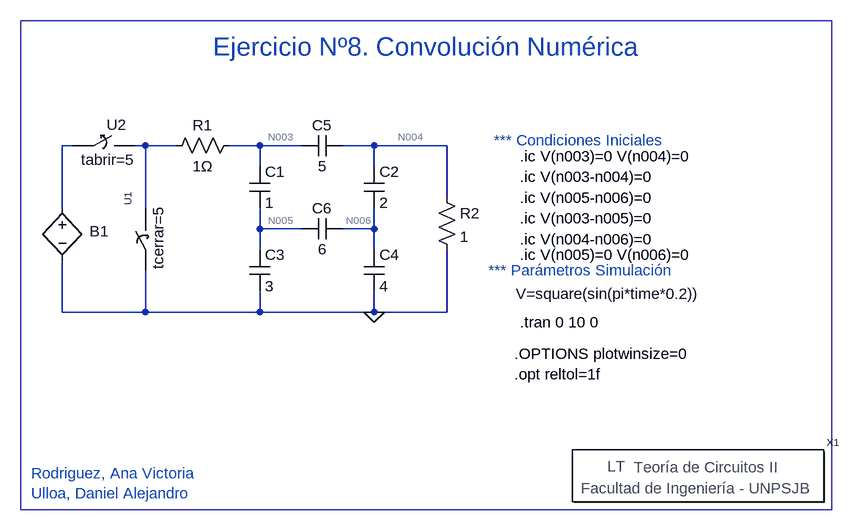
[diagram p0: schematic 08.asc]
08.asc, the LTspice schematic file:
Version 4
SHEET 1 1860 1348
WIRE -256 -128 -272 -128
WIRE -144 -128 -160 -128
WIRE -96 -128 -144 -128
WIRE 32 -128 -16 -128
WIRE 96 -128 32 -128
WIRE 208 -128 160 -128
WIRE 320 -128 208 -128
WIRE 32 -96 32 -128
WIRE 208 -96 208 -128
WIRE 320 -48 320 -128
WIRE -272 -32 -272 -128
WIRE -144 -32 -144 -128
WIRE 32 0 32 -32
WIRE 96 0 32 0
WIRE 208 0 208 -32
WIRE 208 0 160 0
WIRE 32 32 32 0
WIRE 208 32 208 0
WIRE -272 128 -272 48
WIRE -144 128 -144 64
WIRE -144 128 -272 128
WIRE 32 128 32 96
WIRE 32 128 -144 128
WIRE 208 128 208 96
WIRE 208 128 32 128
WIRE 320 128 320 32
WIRE 320 128 208 128
FLAG 208 128 0
SYMBOL Circuitos2\\Letreros\\Teoría\ de\ Circuitos\ II 704 384 R0
SYMATTR InstName X1
SYMBOL cap 16 -96 R0
SYMATTR InstName C1
SYMATTR Value 1
SYMBOL cap 16 32 R0
SYMATTR InstName C3
SYMATTR Value 3
SYMBOL cap 160 -16 R90
WINDOW 0 0 32 VBottom 2
WINDOW 3 32 32 VTop 2
SYMATTR InstName C6
SYMATTR Value 6
SYMBOL cap 192 -96 R0
SYMATTR InstName C2
SYMATTR Value 2
SYMBOL cap 192 32 R0
SYMATTR InstName C4
SYMATTR Value 4
SYMBOL res 304 -64 R0
SYMATTR InstName R2
SYMATTR Value 1
SYMBOL res 0 -144 R90
WINDOW 0 0 56 VBottom 2
WINDOW 3 32 56 VTop 2
SYMATTR InstName R1
SYMATTR Value 1Ω
SYMBOL cap 160 -144 R90
WINDOW 0 0 32 VBottom 2
WINDOW 3 32 32 VTop 2
SYMATTR InstName C5
SYMATTR Value 5
SYMBOL Circuitos2\\Llaves\\ltcerrar -144 16 R270
SYMATTR SpiceLine tcerrar=5
SYMATTR InstName U1
SYMATTR SpiceLine2 ttran=1p Rclosed=1m Ropen=1T
SYMBOL bv -272 -48 R0
WINDOW 0 42 52 Left 2
WINDOW 3 698 148 Left 2
SYMATTR InstName B1
SYMATTR Value V=square(sin(pi*time*0.2))
SYMBOL Circuitos2\\Llaves\\ltabrir -208 -128 R0
SYMATTR InstName U2
SYMATTR SpiceLine tabrir=5
SYMATTR SpiceLine2 ttran=1p Rclosed=1m Ropen=1T
TEXT 288 -280 Center 4 ;Ejercicio Nº8. Convolución Numérica
TEXT -320 376 Left 2 ;Rodriguez, Ana Victoria\nUlloa, Daniel Alejandro
TEXT 392 -136 Left 2 ;*** Condiciones Iniciales
TEXT 384 64 Left 2 ;*** Parámetros Simulación
TEXT 432 -80 Left 2 !.ic V(n003-n004)=0
TEXT 432 144 Left 2 !.tran 0 10 0
TEXT 432 -48 Left 2 !.ic V(n005-n006)=0
TEXT 432 -16 Left 2 !.ic V(n003-n005)=0
TEXT 432 16 Left 2 !.ic V(n004-n006)=0
TEXT 432 40 Left 2 !.ic V(n005)=0 V(n006)=0
TEXT 432 -112 Left 2 !.ic V(n003)=0 V(n004)=0
TEXT 424 192 Left 2 !.OPTIONS plotwinsize=0
TEXT 424 224 Left 2 !.opt reltol=1f
RECTANGLE Normal 912 432 -336 -320

The netlist it stands for:
* 08.asc
XX1 Teoría de Circuitos II
C1 N003 N005 1
C3 N005 0 3
C6 N006 N005 6
C2 N004 N006 2
C4 N006 0 4
R2 N004 0 1
R1 N003 N002 1Ω
C5 N004 N003 5
XU1 0 N002 Ltcerrar Ltcerrar tcerrar=5 ttran=1p Rclosed=1m Ropen=1T  ; pins 1 2
B1 N001 0 V=square(sin(pi*time*0.2))
XU2 N001 N002 Ltabrir tabrir=5 ttran=1p Rclosed=1m Ropen=1T  ; pins 1 2
* Ejercicio Nº8. Convolución Numérica
* Rodriguez, Ana Victoria
* Ulloa, Daniel Alejandro
* *** Condiciones Iniciales
* *** Parámetros Simulación
.ic V(n003-n004)=0
.tran 0 10 0
.ic V(n005-n006)=0
.ic V(n003-n005)=0
.ic V(n004-n006)=0
.ic V(n005)=0 V(n006)=0
.ic V(n003)=0 V(n004)=0
.OPTIONS plotwinsize=0
.opt reltol=1f
.lib ..\sym\Circuitos2\Llaves\llaves.lib
.backanno
.end